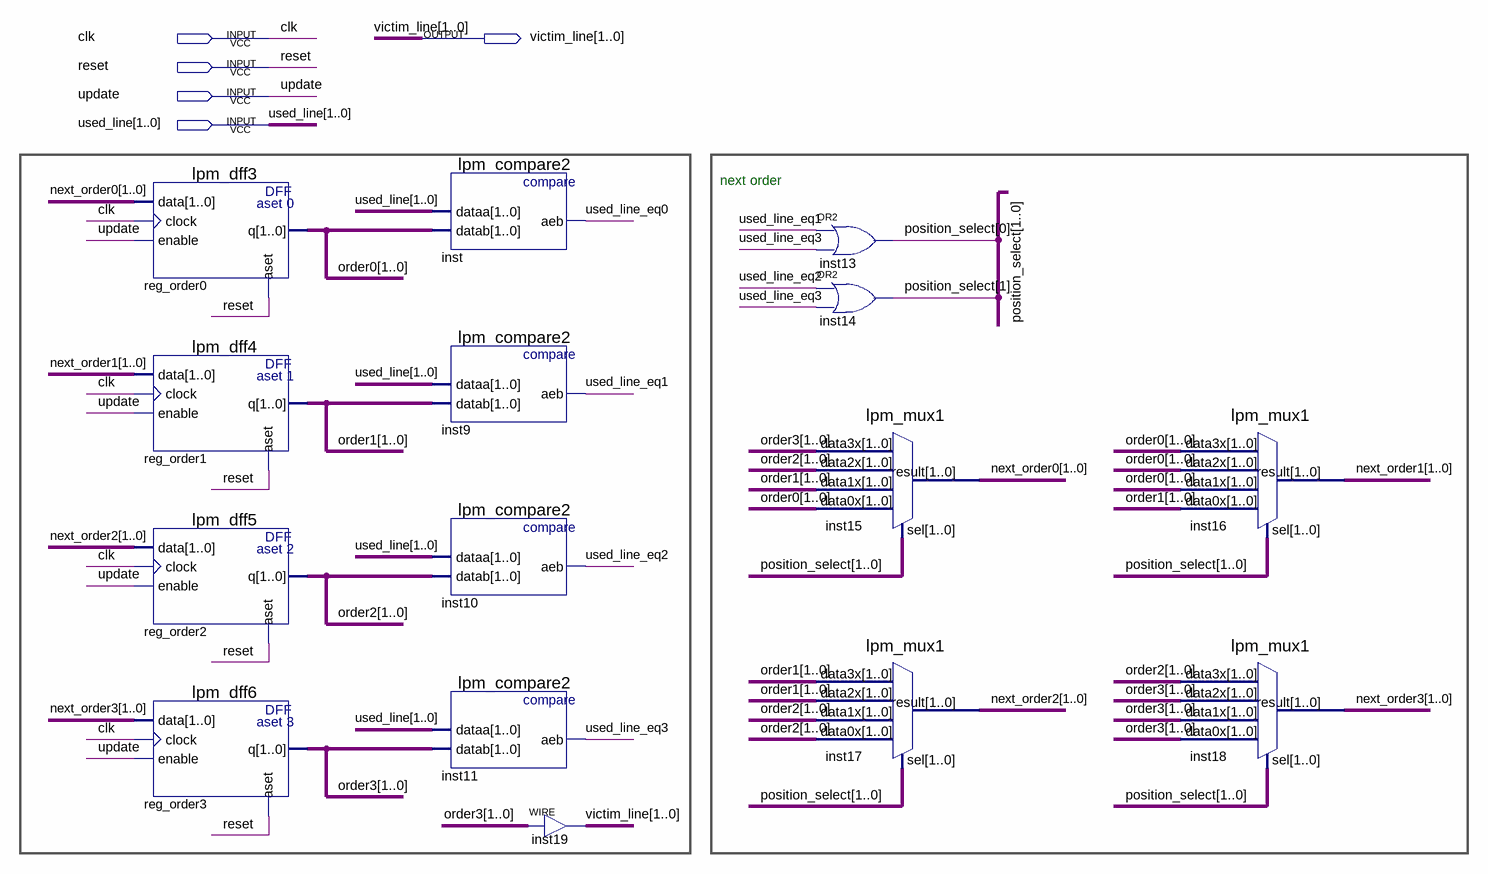
[diagram p0: schematic sheet]
// Quartus schematic lru4.bdf as structural Verilog: 15 symbols, 5 pins
module lru4 (
  input  clk,
  input  reset,
  input  update,
  input  [1:0] used_line,
  output [1:0] victim_line
);

  wire used_line_eq0, used_line_eq1, used_line_eq2, used_line_eq3;
  wire [1:0] next_order0, next_order1, next_order2, next_order3, order0, order1, order2, order3,
       position_select;

  lpm_dff3 reg_order0 (.data(next_order0), .clock(clk), .enable(update), .aset(reset), .q(order0));
  lpm_dff4 reg_order1 (.data(next_order1), .clock(clk), .enable(update), .aset(reset), .q(order1));
  lpm_dff5 reg_order2 (.data(next_order2), .clock(clk), .enable(update), .aset(reset), .q(order2));
  lpm_dff6 reg_order3 (.data(next_order3), .clock(clk), .enable(update), .aset(reset), .q(order3));
  lpm_compare2 inst (.dataa(used_line), .datab(order0), .aeb(used_line_eq0));
  lpm_compare2 inst9 (.dataa(used_line), .datab(order1), .aeb(used_line_eq1));
  lpm_compare2 inst10 (.dataa(used_line), .datab(order2), .aeb(used_line_eq2));
  lpm_compare2 inst11 (.dataa(used_line), .datab(order3), .aeb(used_line_eq3));
  assign victim_line = order3;  // WIRE inst19
  or inst13 (position_select[0], used_line_eq1, used_line_eq3);
  or inst14 (position_select[1], used_line_eq2, used_line_eq3);
  lpm_mux1 inst15 (
    .data3x(order3), .data2x(order2), .data1x(order1), .data0x(order0), .sel(position_select),
    .result(next_order0));
  lpm_mux1 inst17 (
    .data3x(order1), .data2x(order1), .data1x(order2), .data0x(order2), .sel(position_select),
    .result(next_order2));
  lpm_mux1 inst16 (
    .data3x(order0), .data2x(order0), .data1x(order0), .data0x(order1), .sel(position_select),
    .result(next_order1));
  lpm_mux1 inst18 (
    .data3x(order2), .data2x(order3), .data1x(order3), .data0x(order3), .sel(position_select),
    .result(next_order3));

  // Notes on the sheet:
  //   next order
endmodule
